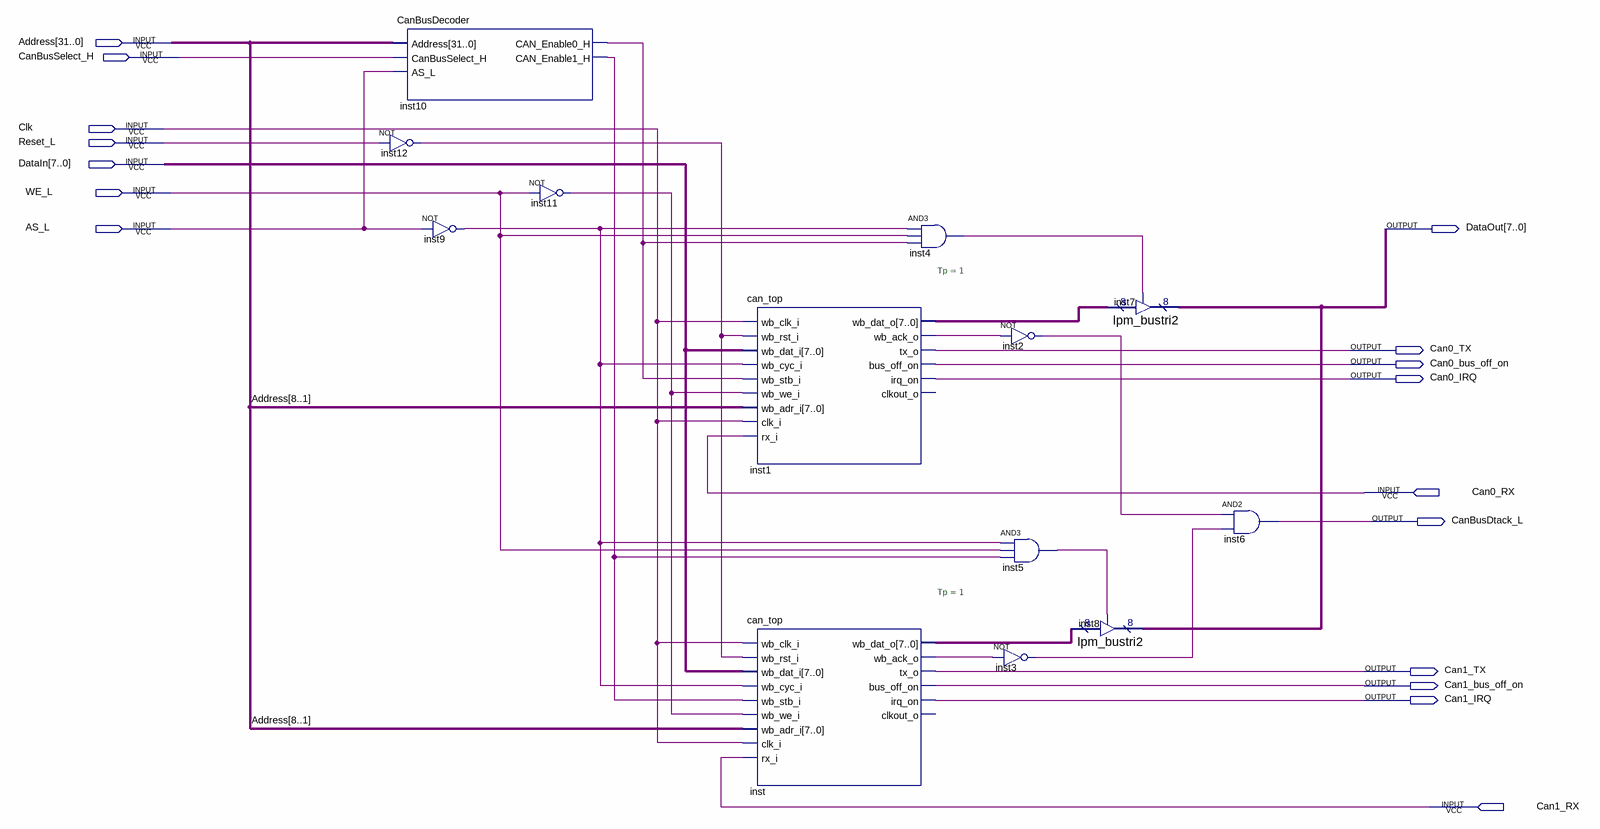
[diagram p0: schematic sheet]
// Quartus schematic slartibartfast.bdf as structural Verilog: 13 symbols, 17 pins
module slartibartfast (
  input  [31:0] Address,
  input  CanBusSelect_H,
  input  Clk,
  input  Reset_L,
  input  [7:0] DataIn,
  input  WE_L,
  input  AS_L,
  input  Can0_RX,
  input  Can1_RX,
  output [7:0] DataOut,
  output Can0_TX,
  output Can0_bus_off_on,
  output Can0_IRQ,
  output CanBusDtack_L,
  output Can1_TX,
  output Can1_bus_off_on,
  output Can1_IRQ
);

  wire inst1_wb_ack_o, inst2_out, inst3_out, inst4_out, inst5_out, inst9_out, inst10_can_enable0_h,
       inst10_can_enable1_h, inst11_out, inst12_out, inst_wb_ack_o;
  wire [7:0] inst1_wb_dat_o, inst_wb_dat_o;

  not inst12 (inst12_out, Reset_L);
  CanBusDecoder inst10 (
    .Address(Address), .CanBusSelect_H(CanBusSelect_H), .AS_L(AS_L), .CAN_Enable0_H(inst10_can_enable0_h),
    .CAN_Enable1_H(inst10_can_enable1_h));
  not inst9 (inst9_out, AS_L);
  not inst11 (inst11_out, WE_L);
  can_top #(.Tp(1)) inst1 (
    .wb_clk_i(Clk), .wb_rst_i(inst12_out), .wb_dat_i(DataIn), .wb_cyc_i(inst9_out),
    .wb_stb_i(inst10_can_enable0_h), .wb_we_i(inst11_out), .wb_adr_i(Address[8:1]), .clk_i(Clk),
    .rx_i(Can0_RX), .wb_dat_o(inst1_wb_dat_o), .wb_ack_o(inst1_wb_ack_o), .tx_o(Can0_TX),
    .bus_off_on(Can0_bus_off_on), .irq_on(Can0_IRQ));  // open: clkout_o
  can_top #(.Tp(1)) inst (
    .wb_clk_i(Clk), .wb_rst_i(inst12_out), .wb_dat_i(DataIn), .wb_cyc_i(inst9_out),
    .wb_stb_i(inst10_can_enable1_h), .wb_we_i(inst11_out), .wb_adr_i(Address[8:1]), .clk_i(Clk),
    .rx_i(Can1_RX), .wb_dat_o(inst_wb_dat_o), .wb_ack_o(inst_wb_ack_o), .tx_o(Can1_TX),
    .bus_off_on(Can1_bus_off_on), .irq_on(Can1_IRQ));  // open: clkout_o
  and inst4 (inst4_out, inst9_out, WE_L, inst10_can_enable0_h);
  not inst2 (inst2_out, inst1_wb_ack_o);
  and inst5 (inst5_out, inst9_out, WE_L, inst10_can_enable1_h);
  not inst3 (inst3_out, inst_wb_ack_o);
  lpm_bustri2 inst7 (.enabledt(inst4_out), .data(inst1_wb_dat_o), .tridata(DataOut));
  lpm_bustri2 inst8 (.enabledt(inst5_out), .data(inst_wb_dat_o), .tridata(DataOut));
  and inst6 (CanBusDtack_L, inst2_out, inst3_out);
endmodule
